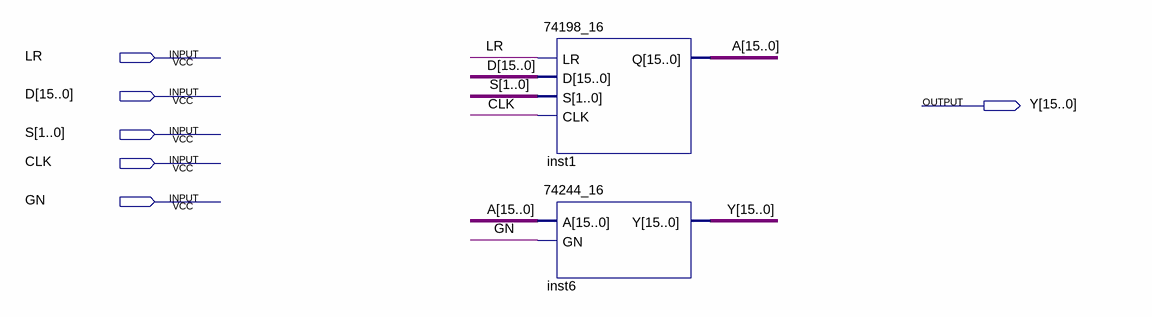
[diagram p0: schematic sheet]
// Quartus schematic shift.bdf as structural Verilog: 2 symbols, 6 pins
module shift (
  input  LR,
  input  [15:0] D,
  input  [1:0] S,
  input  CLK,
  input  GN,
  output [15:0] Y
);

  wire [15:0] A;

  \74198_16  inst1 (.LR(LR), .D(D), .S(S), .CLK(CLK), .Q(A));
  \74244_16  inst6 (.A(A), .GN(GN), .Y(Y));
endmodule
